# Altium schematic sheet plc_module_xs.00001.001_STM32.SchDoc: =GlobalProjectName
size 410 x 297 mm; ApprovedBy: Утвердил; CheckedBy: Проверил; Author: Разработал; SheetNumber: Лист; SheetTotal: Листов; PageSetup: Record=PageOptions|CenterHorizontal=True|CenterVertical=True|PrintScale=1.00|XCorrection=1.00|YCorrection=1.00|PrintKind=1|BorderSize=5000000|LeftOffset=0|BottomOffset=0|Orientation=2|PaperLength=1000|PaperWidth=1000|Scale=100|PaperSource=15|PrintQuality=1200|MediaType=1|DitherType=10|PaperKind=A3|PrintScaleMode=1; Weight: -; ScaleFactor: -; NormInspection: Норм.Контр.
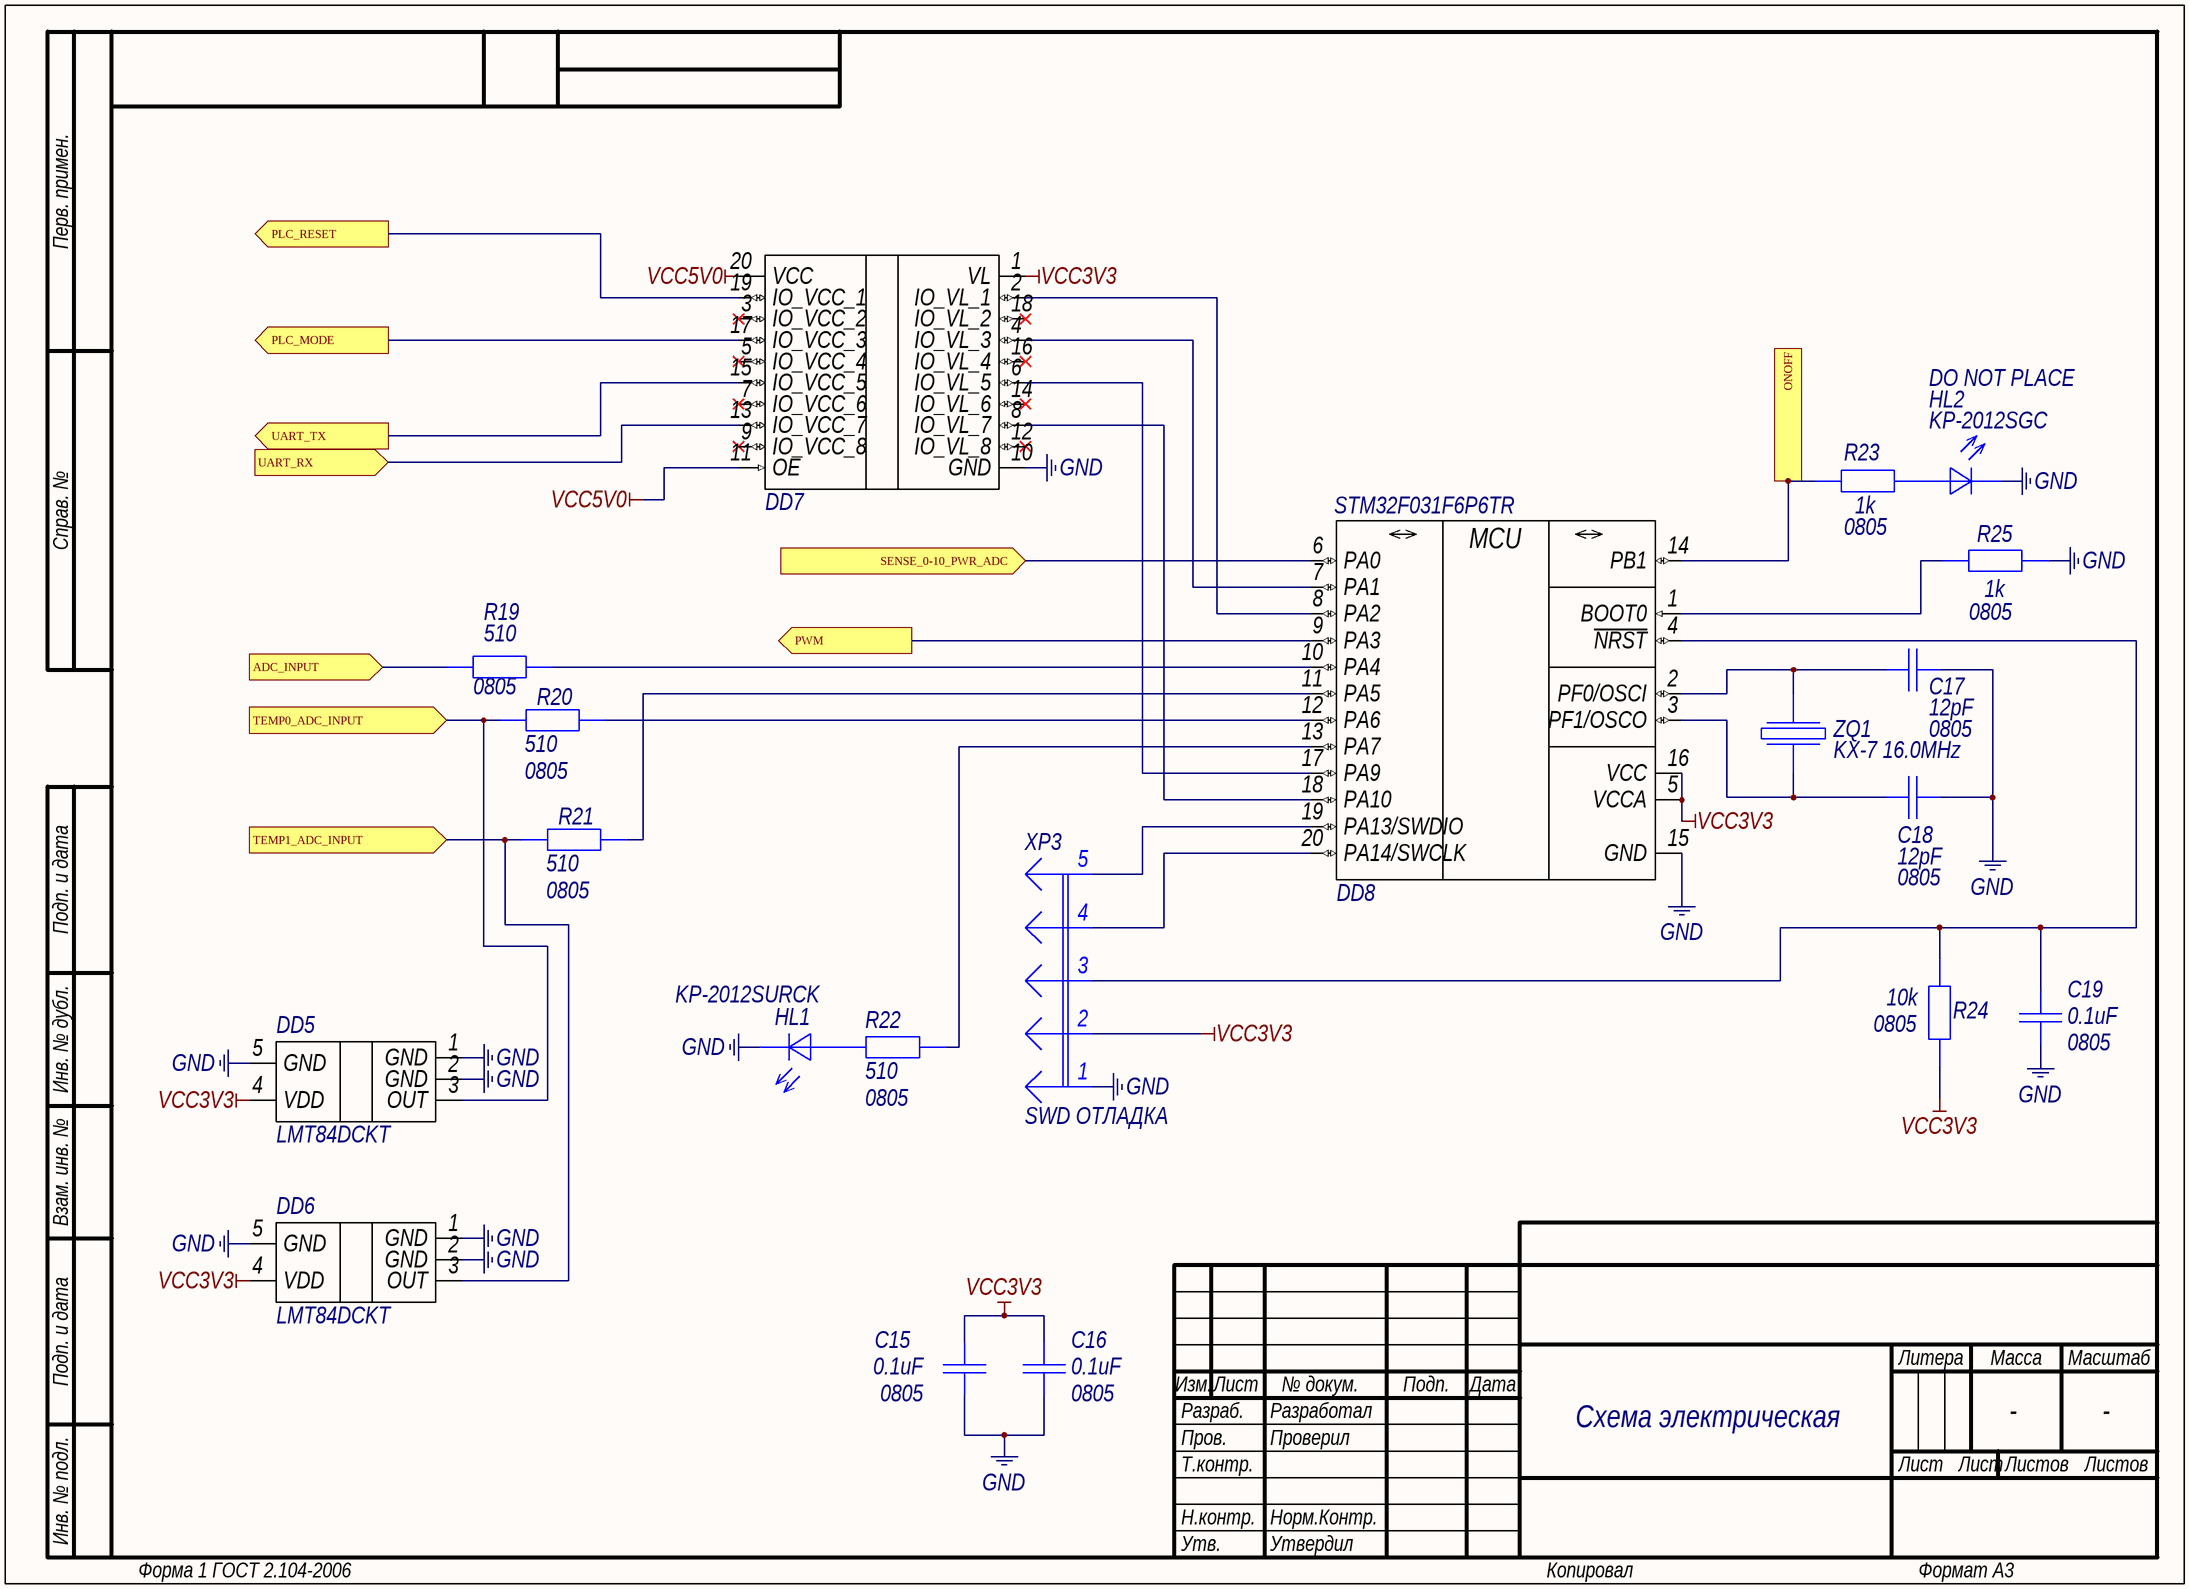
[diagram p0: plc_module_xs.00001.001_STM32.SchDoc]

## Parts
C15  Footprint: 0805  [C0805]  (hidden comment: 0.1uF)
C16  Footprint: 0805  [C0805]  (hidden comment: 0.1uF)
C17  12pF  Footprint: 0805  [C0805]
C18  12pF  Footprint: 0805  [C0805]
C19  Footprint: 0805  [C0805]  (hidden comment: 0.1uF)
DD5  LMT84DCKT  [SOT65P210X110-5N]
DD6  LMT84DCKT  [SOT65P210X110-5N]
DD7  ST2378ETTR  [SOP65P640X120-20N]  (value not drawn)
DD8  STM32F031F6P6TR  [STM-TSSOP20_N]
HL1  KP-2012SURCK  [LD0805]
HL2  DO NOT PLACE  Part Number: KP-2012SGC  [LD0805]
R19  Footprint: 0805  [R0805]  (hidden comment: 510)
R20  Footprint: 0805  [R0805]  (hidden comment: 510)
R21  Footprint: 0805  [R0805]  (hidden comment: 510)
R22  Footprint: 0805  [R0805]  (hidden comment: 510)
R23  Footprint: 0805  [R0805]  (hidden comment: 1k)
R24  Footprint: 0805  [R0805]  (hidden comment: 10k)
R25  Footprint: 0805  [R0805]  (hidden comment: 1k)
XP3  SWD ОТЛАДКА  [PLS-5]
ZQ1  value KX-7 16.0MHz  [SMD 3.2x2.5mm]  (hidden comment: Crystal-1_3p)

## Ports
ADC_INPUT (in), ONOFF (out), PLC_MODE (out), PLC_RESET (out), PWM (out), SENSE_0-10_PWR_ADC (in), TEMP0_ADC_INPUT (in), TEMP1_ADC_INPUT (in), UART_RX (in), UART_TX (out)

## Nets
GND: C15.2 C16.1 C17.1 C18.1 C19.1 DD5.1(GND) DD5.2(GND) DD5.5(GND) DD6.1(GND) DD6.2(GND) DD6.5(GND) DD7.10(GND) DD8.15(GND) HL1.2(К) HL2.2(К) R25.2 XP3.1
VCC3V3: C15.1 C16.2 DD5.4(VDD) DD6.4(VDD) DD7.1(VL) DD8.5(VCCA) DD8.16(VCC) R24.1 XP3.2
VCC5V0: DD7.11(OE) DD7.20(VCC)
ADC_INPUT: R19.2 ; port ADC_INPUT
ONOFF: DD8.14(PB1) R23.1 ; port ONOFF
PLC_MODE: DD7.17(IO_VCC_3) ; port PLC_MODE
PLC_RESET: DD7.19(IO_VCC_1) ; port PLC_RESET
PWM: DD8.9(PA3) ; port PWM
SENSE_0-10_PWR_ADC: DD8.6(PA0) ; port SENSE_0-10_PWR_ADC
TEMP0_ADC_INPUT: DD5.3(OUT) R20.2 ; port TEMP0_ADC_INPUT
TEMP1_ADC_INPUT: DD6.3(OUT) R21.2 ; port TEMP1_ADC_INPUT
UART_RX: DD7.13(IO_VCC_7) ; port UART_RX
UART_TX: DD7.15(IO_VCC_5) ; port UART_TX
NetC17_2: C17.2 DD8.2(PF0/OSCI) ZQ1.3
NetC18_2: C18.2 DD8.3(PF1/OSCO) ZQ1.1
NetC19_2: C19.2 DD8.4(~{NRST}) R24.2 XP3.3
NetDD7_2: DD7.2(IO_VL_1) DD8.8(PA2)
NetDD7_4: DD7.4(IO_VL_3) DD8.7(PA1)
NetDD7_6: DD7.6(IO_VL_5) DD8.17(PA9)
NetDD7_8: DD7.8(IO_VL_7) DD8.18(PA10)
NetDD8_1: DD8.1(BOOT0) R25.1
NetDD8_10: DD8.10(PA4) R19.1
NetDD8_11: DD8.11(PA5) R21.1
NetDD8_12: DD8.12(PA6) R20.1
NetDD8_13: DD8.13(PA7) R22.1
NetDD8_19: DD8.19(PA13/SWDIO) XP3.5
NetDD8_20: DD8.20(PA14/SWCLK) XP3.4
NetHL1_1: HL1.1(А) R22.2
NetHL2_1: HL2.1(А) R23.2

Not connected (* = marked no-connect by the designer): DD7 3(IO_VCC_2)* 5(IO_VCC_4)* 7(IO_VCC_6)* 9(IO_VCC_8)* 12(IO_VL_8)* 14(IO_VL_6)* 16(IO_VL_4)* 18(IO_VL_2)*

## Notes on the sheet
- Схема электрическая
  принципиальная
- Перв. примен.
- Справ. №
- Подп. и дата
- Инв. № дубл.
- Взам. инв. №
- Разраб.
- Изм.
- Лист
- № докум.
- Подп.
- Дата
- Литера
- Масса
- Масштаб
- Пров.
- Т.контр.
- Листов
- Инв. № подл.
- Н.контр.
- Утв.
- Форма 1 ГОСТ 2.104-2006
- Копировал
- Формат А3
- (in symbol STM32F031F6P6TR) MCU

## Library data of the parts
C15 C16 C19 = GRM21BR71H104KA01L: Manufacturer: Murata; Type: Конденсатор; ID: 138; Voltage: 50V; Tolerance: ±10%; Dielectric Type: X7R; Application Category: 1; Working Temperature Min: -55°С; Working Temperature Max: +125°С; Published: 18.05.2010; Publisher: Andrew Danich; Part Number: GRM21BR71H104KA01L; Value: 0.1uF
C17 C18 = CC0805JRNPO9BN120: Manufacturer: Yageo; Type: Конденсатор; ID: 239; Voltage: 50V; Tolerance: ±5%; Dielectric Type: NP0; Application Category: 1; Working Temperature Min: -55°С; Working Temperature Max: +125°С; Published: 18.05.2010; Publisher: Andrew Danich; Part Number: CC0805JRNPO9BN120; Value: 12pF; Distributor1: Terraelectronica
DD5 DD6 = LMT84DCKT: LMT84/LMT84-Q1 1.5V, SC70/TO-92/TO-126,Analog Temperature Sensors with Class-AB Output; Manufacturer: Texas Instruments; ID: 9; URL1: <div><a href="https://www.terraelectronica.ru/product/1196420">https://www.terraelectronica.ru/product/1196420</a></div>; Part Number: LMT84DCKT; Value: LMT84DCKT; Distributor1: terraelectronica
DD7 = ST2378ETTR: 8-bit dual supply 1.71 V to 5.5 V level translator with I/O VCC ±15 kV ESD protection; Manufacturer: STMicroelectronics; ID: 8; Input Voltage: 1.7V to 5.5V; URL1: <div><a href="https://www.terraelectronica.ru/product/448973">https://www.terraelectronica.ru/product/448973</a></div>; Published: 18.08.2014; Publisher: Andrew Danich; Type: Микросхема; Part Number: ST2378ETTR; Value: ST2378ETTR; Distributor1: terraelectronica
DD8 = STM32F031F6P6TR: Manufacturer: STMicroelectronics; ID: 29; Supply Operation: +2.4…3.6V; Flash: 32K; SRAM: 4K; Prog Interface: SWD; I/O Lines: 15; Operation Frequency: 48MHz; Application Category: 1; Working Temperature Min: -40°С; Working Temperature Max: +85°С; Published: 27.07.2015; Publisher: Andrew Danich; Type: Микросхема; Part Number: STM32F031F6P6TR; Value: STM32F031F6P6TR; EEPROM: -; Distributor1: Terraelectronica; Distributor2: ChipDip; URL1: https://www.terraelectronica.ru/product/2176678
HL1 = KP-2012SURCK: Manufacturer: Kingbright; Type: Индикатор единичный; ID: 23; Forward Voltage: 2.5V; Forward Current: 30mA; Power Dissipation: 75mW; Luminous Flux: 150; Color: Red; Leds: 1; Working Temperature Min: -40°С; Working Temperature Max: +85°С; Published: 03.12.2013; Publisher: Andrew Danich; Part Number: KP-2012SURCK; Value: KP-2012SURCK; Footprint: 0805; Application Category: 1
HL2 = KP-2012SGC: Manufacturer: Kingbright; Type: Индикатор единичный; ID: 21; Forward Voltage: 2.5V; Forward Current: 25mA; Power Dissipation: 62.5mW; Color: Green; Leds: 1; Working Temperature Min: -40°С; Working Temperature Max: +85°С; Published: 03.12.2013; Publisher: Andrew Danich; Value: KP-2012SGC; Footprint: 0805; Application Category: 1
R19-R22 = RC0805JR-07510RL: Manufacturer: Yageo; ID: 153; Limit Voltage: 150V; Tolerance: ±5%; Temperature Coefficient: 100ppm; Total Power Dissipation: 0.125W; Series Type: Thick-Film; Application Category: 1; Working Temperature Min: -55°С; Working Temperature Max: +155°С; Published: 24.03.2010; Publisher: Andrew Danich; Type: Резистор; Part Number: RC0805JR-07510RL; Value: 510
R23 R25 = RC0805JR-071KL: Manufacturer: Yageo; ID: 112; Limit Voltage: 150V; Tolerance: ±5%; Temperature Coefficient: 100ppm; Total Power Dissipation: 0.125W; Series Type: Thick-Film; Application Category: 1; Working Temperature Min: -55°С; Working Temperature Max: +155°С; Published: 24.03.2010; Publisher: Andrew Danich; Type: Резистор; Part Number: RC0805JR-071KL; Value: 1k
R24 = RC0805JR-0710KL: Manufacturer: Yageo; ID: 99; Limit Voltage: 150V; Tolerance: ±5%; Temperature Coefficient: 100ppm; Total Power Dissipation: 0.125W; Series Type: Thick-Film; Application Category: 1; Working Temperature Min: -55°С; Working Temperature Max: +155°С; Published: 24.03.2010; Publisher: Andrew Danich; Type: Резистор; Part Number: RC0805JR-0710KL; Value: 10k
XP3 = PLS-5: Value: PLS-5; ID: 4; Limit Voltage: 250V; Limit Current: 3A; Connector Type: Male; Resistance: 15momh; Surface Finish: Gold; Pitch: 2.54mm; Published: 07.03.2013; Publisher: Andrew Danich; Type: Вилка; Part Number: PLS-5; Pins: 5
ZQ1 = KX-7 16.0MHz: Manufacturer: GEYER ELECTRONIC; ID: 27; Output Frequency: 16МГц; Load Capacitance: 10pF; Temperature Coefficient: ±30ppm; Application Category: 1; Working Temperature Min: -20°С; Working Temperature Max: +70°С; URL1: <div><a href="https://www.terraelectronica.ru/product/165772">https://www.terraelectronica.ru/product/165772</a></div>; Published: 12.09.2014; Publisher: Andrew Danich; Type: Резонатор; Part Number: KX-7 16.0MHz; Functional Analog: -; Distributor1: terraelectronica